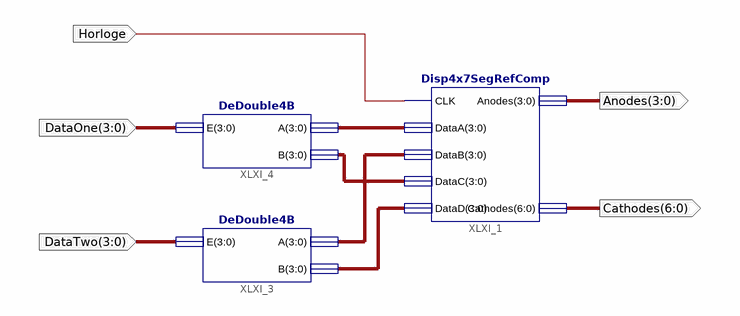
[diagram p0: schematic sheet 1]
// Xilinx ISE schematic Disp4D_Demo.sch (spartan3e) as structural Verilog: 3 symbols, 5 ports
module Disp4D_Demo (
  input  [3:0] DataOne,
  input  [3:0] DataTwo,
  input  Horloge,
  output [3:0] Anodes,
  output [6:0] Cathodes
);

  wire [3:0] XLXN_6, XLXN_20, XLXN_21, XLXN_22;

  Disp4x7SegRefComp XLXI_1 (
    .CLK(Horloge), .DataA(XLXN_6), .DataB(XLXN_20), .DataC(XLXN_21), .DataD(XLXN_22), .Anodes(Anodes),
    .Cathodes(Cathodes));
  DeDouble4B XLXI_4 (.E(DataOne), .A(XLXN_6), .B(XLXN_21));
  DeDouble4B XLXI_3 (.E(DataTwo), .A(XLXN_20), .B(XLXN_22));
endmodule
